# Altium schematic sheet FPGA_IO.SchDoc
size B
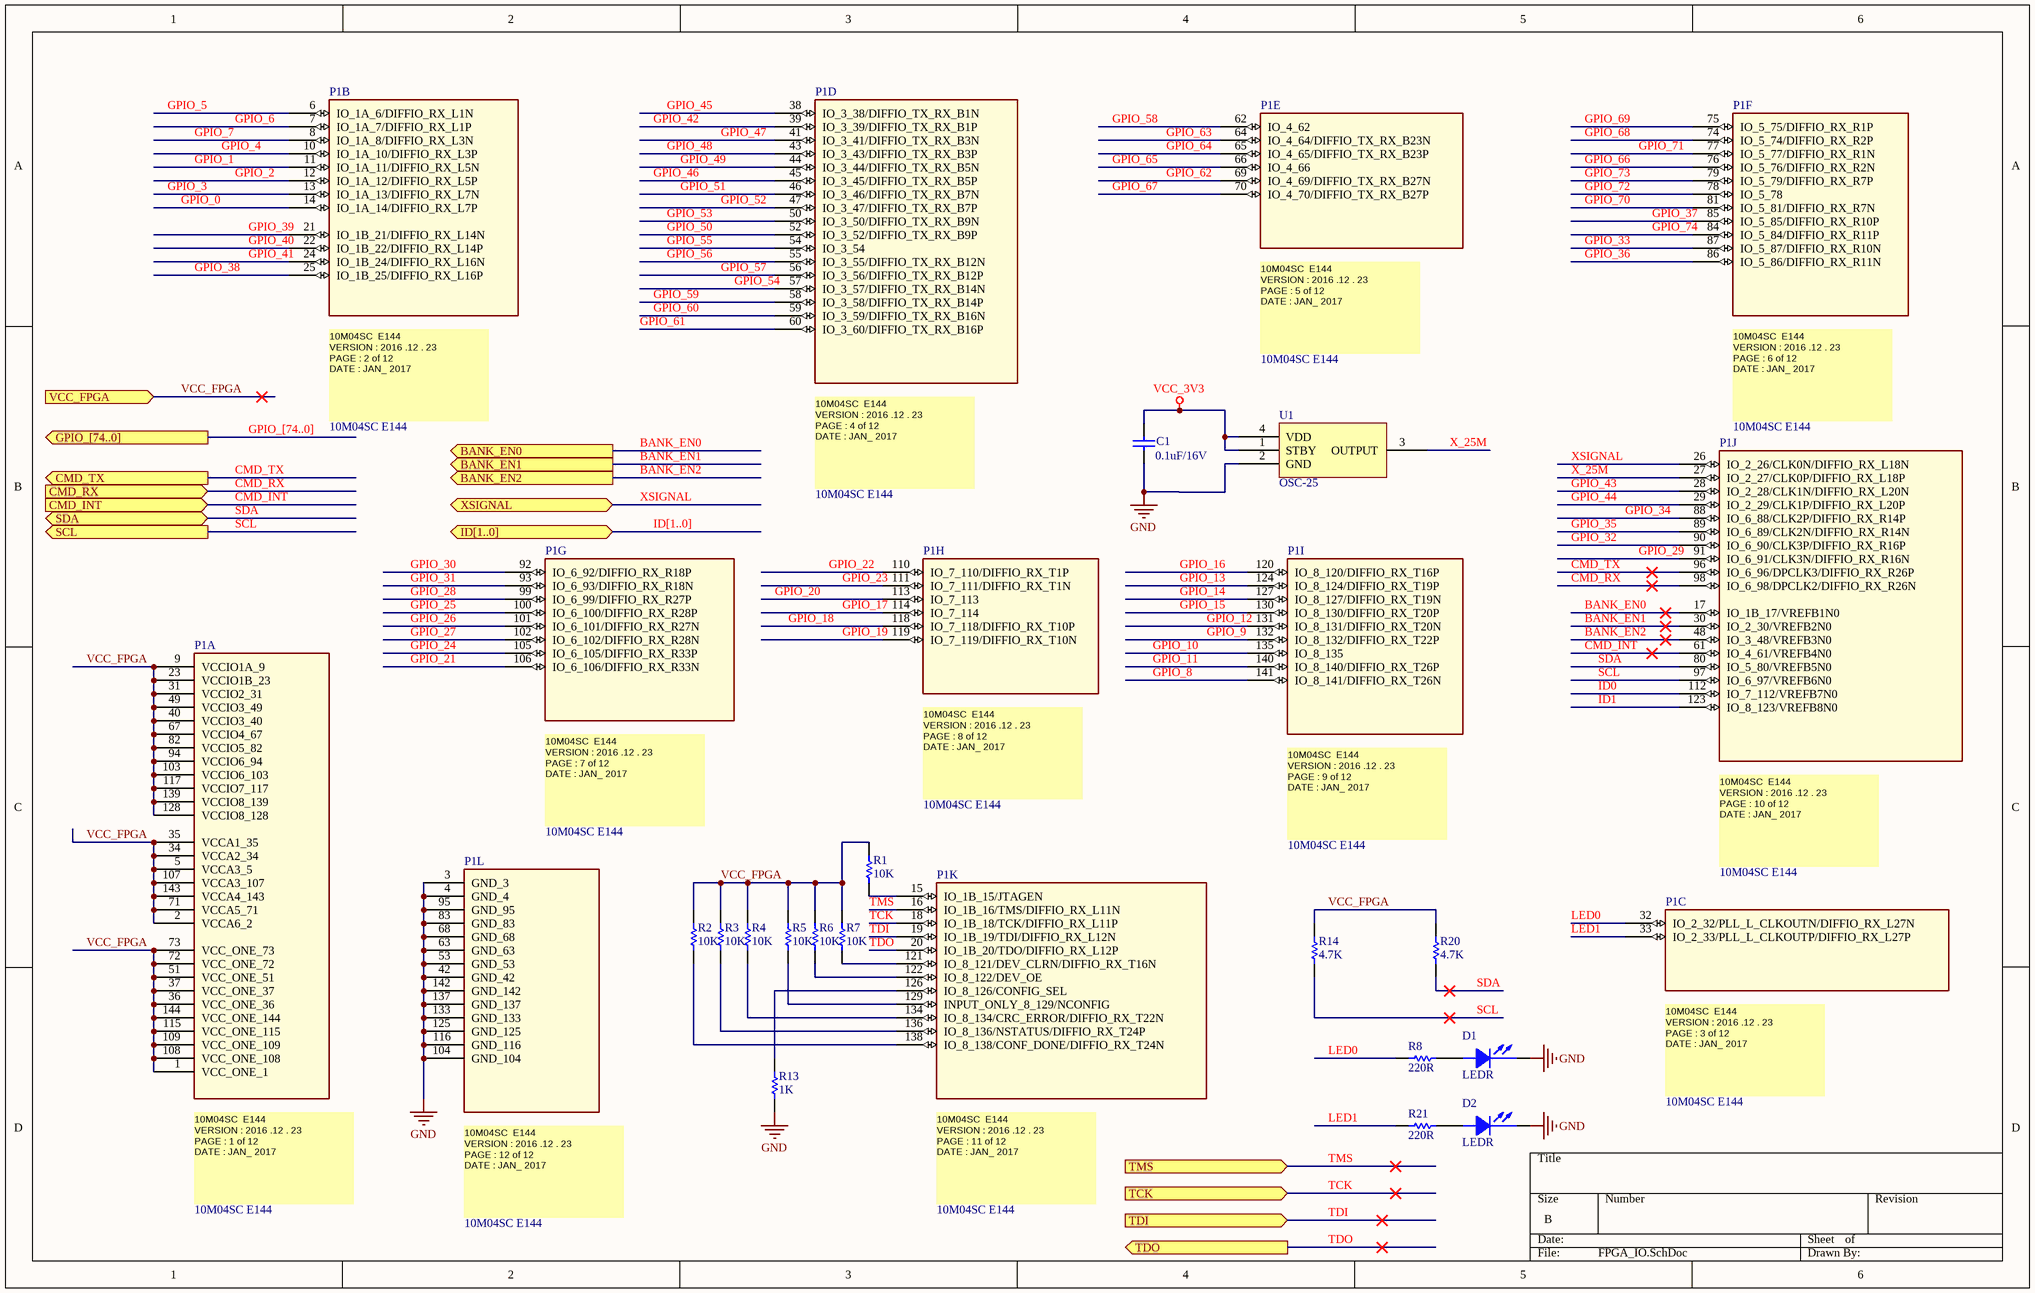
[diagram p0: FPGA_IO.SchDoc]

## Parts
C1  0.1uF/16V  [0603C]
D1  LEDR  [LED_0603]
D2  LEDR  [LED_0603]
P1  10M04SC E144  [10M04SCE144C8G]  (parts A,B,C,D,E,F,G,H,I,J,K,L of 12)
R1  10K  [0603R]
R2  10K  [0603R]
R3  10K  [0603R]
R4  10K  [0603R]
R5  10K  [0603R]
R6  10K  [0603R]
R7  10K  [0603R]
R8  220R  [0603R]
R13  1K  [0603R]
R14  4.7K  [0603R]
R20  4.7K  [0603R]
R21  220R  [0603R]
U1  OSC-25  [ASE-25.000MHZ-LC-T]

## Ports
BANK_EN0 (out), BANK_EN1 (out), BANK_EN2 (out), CMD_INT (in), CMD_RX (in), CMD_TX (out), GPIO_[74..0] (out), ID[1..0] (bidir), SCL (out), SDA (bidir), TCK (in), TDI (in), TDO (out), TMS (in), VCC_FPGA (in), XSIGNAL (bidir)

## Nets
GND: C1.1 D1.2(CATHODE) D2.2(CATHODE) P1.3(GND_3) P1.4(GND_4) P1.42(GND_42) P1.53(GND_53) P1.63(GND_63) P1.68(GND_68) P1.83(GND_83) P1.95(GND_95) P1.104(GND_104) P1.116(GND_116) P1.125(GND_125) P1.133(GND_133) P1.137(GND_137) P1.142(GND_142) R13.1 U1.2(GND)
VCC_3V3: C1.2 U1.1(STBY) U1.4(VDD)
BANK_EN0: P1.17(IO_1B_17/VREFB1N0) ; port BANK_EN0
BANK_EN1: P1.30(IO_2_30/VREFB2N0) ; port BANK_EN1
BANK_EN2: P1.48(IO_3_48/VREFB3N0) ; port BANK_EN2
CMD_INT: P1.61(IO_4_61/VREFB4N0) ; port CMD_INT
CMD_RX: P1.98(IO_6_98/DPCLK2/DIFFIO_RX_R26N) ; port CMD_RX
CMD_TX: P1.96(IO_6_96/DPCLK3/DIFFIO_RX_R26P) ; port CMD_TX
GPIO_0: P1.14(IO_1A_14/DIFFIO_RX_L7P)
GPIO_1: P1.11(IO_1A_11/DIFFIO_RX_L5N)
GPIO_2: P1.12(IO_1A_12/DIFFIO_RX_L5P)
GPIO_3: P1.13(IO_1A_13/DIFFIO_RX_L7N)
GPIO_4: P1.10(IO_1A_10/DIFFIO_RX_L3P)
GPIO_5: P1.6(IO_1A_6/DIFFIO_RX_L1N)
GPIO_6: P1.7(IO_1A_7/DIFFIO_RX_L1P)
GPIO_7: P1.8(IO_1A_8/DIFFIO_RX_L3N)
GPIO_8: P1.141(IO_8_141/DIFFIO_RX_T26N)
GPIO_9: P1.132(IO_8_132/DIFFIO_RX_T22P)
GPIO_10: P1.135(IO_8_135)
GPIO_11: P1.140(IO_8_140/DIFFIO_RX_T26P)
GPIO_12: P1.131(IO_8_131/DIFFIO_RX_T20N)
GPIO_13: P1.124(IO_8_124/DIFFIO_RX_T19P)
GPIO_14: P1.127(IO_8_127/DIFFIO_RX_T19N)
GPIO_15: P1.130(IO_8_130/DIFFIO_RX_T20P)
GPIO_16: P1.120(IO_8_120/DIFFIO_RX_T16P)
GPIO_17: P1.114(IO_7_114)
GPIO_18: P1.118(IO_7_118/DIFFIO_RX_T10P)
GPIO_19: P1.119(IO_7_119/DIFFIO_RX_T10N)
GPIO_20: P1.113(IO_7_113)
GPIO_21: P1.106(IO_6_106/DIFFIO_RX_R33N)
GPIO_22: P1.110(IO_7_110/DIFFIO_RX_T1P)
GPIO_23: P1.111(IO_7_111/DIFFIO_RX_T1N)
GPIO_24: P1.105(IO_6_105/DIFFIO_RX_R33P)
GPIO_25: P1.100(IO_6_100/DIFFIO_RX_R28P)
GPIO_26: P1.101(IO_6_101/DIFFIO_RX_R27N)
GPIO_27: P1.102(IO_6_102/DIFFIO_RX_R28N)
GPIO_28: P1.99(IO_6_99/DIFFIO_RX_R27P)
GPIO_29: P1.91(IO_6_91/CLK3N/DIFFIO_RX_R16N)
GPIO_30: P1.92(IO_6_92/DIFFIO_RX_R18P)
GPIO_31: P1.93(IO_6_93/DIFFIO_RX_R18N)
GPIO_32: P1.90(IO_6_90/CLK3P/DIFFIO_RX_R16P)
GPIO_33: P1.87(IO_5_87/DIFFIO_RX_R10N)
GPIO_34: P1.88(IO_6_88/CLK2P/DIFFIO_RX_R14P)
GPIO_35: P1.89(IO_6_89/CLK2N/DIFFIO_RX_R14N)
GPIO_36: P1.86(IO_5_86/DIFFIO_RX_R11N)
GPIO_37: P1.85(IO_5_85/DIFFIO_RX_R10P)
GPIO_38: P1.25(IO_1B_25/DIFFIO_RX_L16P)
GPIO_39: P1.21(IO_1B_21/DIFFIO_RX_L14N)
GPIO_40: P1.22(IO_1B_22/DIFFIO_RX_L14P)
GPIO_41: P1.24(IO_1B_24/DIFFIO_RX_L16N)
GPIO_42: P1.39(IO_3_39/DIFFIO_TX_RX_B1P)
GPIO_43: P1.28(IO_2_28/CLK1N/DIFFIO_RX_L20N)
GPIO_44: P1.29(IO_2_29/CLK1P/DIFFIO_RX_L20P)
GPIO_45: P1.38(IO_3_38/DIFFIO_TX_RX_B1N)
GPIO_46: P1.45(IO_3_45/DIFFIO_TX_RX_B5P)
GPIO_47: P1.41(IO_3_41/DIFFIO_TX_RX_B3N)
GPIO_48: P1.43(IO_3_43/DIFFIO_TX_RX_B3P)
GPIO_49: P1.44(IO_3_44/DIFFIO_TX_RX_B5N)
GPIO_50: P1.52(IO_3_52/DIFFIO_TX_RX_B9P)
GPIO_51: P1.46(IO_3_46/DIFFIO_TX_RX_B7N)
GPIO_52: P1.47(IO_3_47/DIFFIO_TX_RX_B7P)
GPIO_53: P1.50(IO_3_50/DIFFIO_TX_RX_B9N)
GPIO_54: P1.57(IO_3_57/DIFFIO_TX_RX_B14N)
GPIO_55: P1.54(IO_3_54)
GPIO_56: P1.55(IO_3_55/DIFFIO_TX_RX_B12N)
GPIO_57: P1.56(IO_3_56/DIFFIO_TX_RX_B12P)
GPIO_58: P1.62(IO_4_62)
GPIO_59: P1.58(IO_3_58/DIFFIO_TX_RX_B14P)
GPIO_60: P1.59(IO_3_59/DIFFIO_TX_RX_B16N)
GPIO_61: P1.60(IO_3_60/DIFFIO_TX_RX_B16P)
GPIO_62: P1.69(IO_4_69/DIFFIO_TX_RX_B27N)
GPIO_63: P1.64(IO_4_64/DIFFIO_TX_RX_B23N)
GPIO_64: P1.65(IO_4_65/DIFFIO_TX_RX_B23P)
GPIO_65: P1.66(IO_4_66)
GPIO_66: P1.76(IO_5_76/DIFFIO_RX_R2N)
GPIO_67: P1.70(IO_4_70/DIFFIO_TX_RX_B27P)
GPIO_68: P1.74(IO_5_74/DIFFIO_RX_R2P)
GPIO_69: P1.75(IO_5_75/DIFFIO_RX_R1P)
GPIO_70: P1.81(IO_5_81/DIFFIO_RX_R7N)
GPIO_71: P1.77(IO_5_77/DIFFIO_RX_R1N)
GPIO_72: P1.78(IO_5_78)
GPIO_73: P1.79(IO_5_79/DIFFIO_RX_R7P)
GPIO_74: P1.84(IO_5_84/DIFFIO_RX_R11P)
ID0: P1.112(IO_7_112/VREFB7N0)
ID1: P1.123(IO_8_123/VREFB8N0)
LED0: P1.32(IO_2_32/PLL_L_CLKOUTN/DIFFIO_RX_L27N) R8.2
LED1: P1.33(IO_2_33/PLL_L_CLKOUTP/DIFFIO_RX_L27P) R21.2
SCL: P1.97(IO_6_97/VREFB6N0) R14.1 ; port SCL
SDA: P1.80(IO_5_80/VREFB5N0) R20.1 ; port SDA
TCK: P1.18(IO_1B_18/TCK/DIFFIO_RX_L11P) ; port TCK
TDI: P1.19(IO_1B_19/TDI/DIFFIO_RX_L12N) ; port TDI
TDO: P1.20(IO_1B_20/TDO/DIFFIO_RX_L12P) ; port TDO
TMS: P1.16(IO_1B_16/TMS/DIFFIO_RX_L11N) ; port TMS
VCC_FPGA: P1.1(VCC_ONE_1) P1.2(VCCA6_2) P1.5(VCCA3_5) P1.9(VCCIO1A_9) P1.23(VCCIO1B_23) P1.31(VCCIO2_31) P1.34(VCCA2_34) P1.35(VCCA1_35) P1.36(VCC_ONE_36) P1.37(VCC_ONE_37) P1.40(VCCIO3_40) P1.49(VCCIO3_49) P1.51(VCC_ONE_51) P1.67(VCCIO4_67) P1.71(VCCA5_71) P1.72(VCC_ONE_72) P1.73(VCC_ONE_73) P1.82(VCCIO5_82) P1.94(VCCIO6_94) P1.103(VCCIO6_103) P1.107(VCCA3_107) P1.108(VCC_ONE_108) P1.109(VCC_ONE_109) P1.115(VCC_ONE_115) P1.117(VCCIO7_117) P1.128(VCCIO8_128) P1.139(VCCIO8_139) P1.143(VCCA4_143) P1.144(VCC_ONE_144) R1.1 R2.1 R3.1 R4.1 R5.1 R6.1 R7.1 R14.2 R20.2 ; port VCC_FPGA
X_25M: P1.27(IO_2_27/CLK0P/DIFFIO_RX_L18P) U1.3(OUTPUT)
XSIGNAL: P1.26(IO_2_26/CLK0N/DIFFIO_RX_L18N) ; port XSIGNAL
NetD1_1: D1.1(ANODE) R8.1
NetD2_1: D2.1(ANODE) R21.1
NetP1_15: P1.15(IO_1B_15/JTAGEN) R1.2
NetP1_121: P1.121(IO_8_121/DEV_CLRN/DIFFIO_RX_T16N) R7.2
NetP1_122: P1.122(IO_8_122/DEV_OE) R6.2
NetP1_126: P1.126(IO_8_126/CONFIG_SEL) R13.2
NetP1_129: P1.129(INPUT_ONLY_8_129/NCONFIG) R5.2
NetP1_134: P1.134(IO_8_134/CRC_ERROR/DIFFIO_RX_T22N) R4.2
NetP1_136: P1.136(IO_8_136/NSTATUS/DIFFIO_RX_T24P) R3.2
NetP1_138: P1.138(IO_8_138/CONF_DONE/DIFFIO_RX_T24N) R2.2

## Buses and harness runs
bus GPIO_[74..0] = port GPIO_[74..0]
bus ID[1..0] = port ID[1..0]

## Notes on the sheet
- (in symbol 10M04SC E144, part A) 10M04SC  E144 / VERSION : 2016 .12 . 23 / PAGE : 1 of 12 / DATE : JAN_ 2017 /
- (in symbol 10M04SC E144, part B) 10M04SC  E144 / VERSION : 2016 .12 . 23 / PAGE : 2 of 12 / DATE : JAN_ 2017 /
- (in symbol 10M04SC E144, part C) 10M04SC  E144 / VERSION : 2016 .12 . 23 / PAGE : 3 of 12 / DATE : JAN_ 2017 /
- (in symbol 10M04SC E144, part D) 10M04SC  E144 / VERSION : 2016 .12 . 23 / PAGE : 4 of 12 / DATE : JAN_ 2017 /
- (in symbol 10M04SC E144, part E) 10M04SC  E144 / VERSION : 2016 .12 . 23 / PAGE : 5 of 12 / DATE : JAN_ 2017 /
- (in symbol 10M04SC E144, part F) 10M04SC  E144 / VERSION : 2016 .12 . 23 / PAGE : 6 of 12 / DATE : JAN_ 2017 /
- (in symbol 10M04SC E144, part G) 10M04SC  E144 / VERSION : 2016 .12 . 23 / PAGE : 7 of 12 / DATE : JAN_ 2017 /
- (in symbol 10M04SC E144, part H) 10M04SC  E144 / VERSION : 2016 .12 . 23 / PAGE : 8 of 12 / DATE : JAN_ 2017 /
- (in symbol 10M04SC E144, part I) 10M04SC  E144 / VERSION : 2016 .12 . 23 / PAGE : 9 of 12 / DATE : JAN_ 2017 /
- (in symbol 10M04SC E144, part J) 10M04SC  E144 / VERSION : 2016 .12 . 23 / PAGE : 10 of 12 / DATE : JAN_ 2017 /
- (in symbol 10M04SC E144, part K) 10M04SC  E144 / VERSION : 2016 .12 . 23 / PAGE : 11 of 12 / DATE : JAN_ 2017 /
- (in symbol 10M04SC E144, part L) 10M04SC  E144 / VERSION : 2016 .12 . 23 / PAGE : 12 of 12 / DATE : JAN_ 2017 /

## Library data of the parts
C1 = Cap: Multilayer Ceramic Capacitors MLCC - SMD/SMT 0603 16VDC 0.1uF 10% X7R AEC-Q200; Mfr: Taiyo Yuden; Mfr Part No: EMK107B7104KAHT; Package: 0603; Price: 0.101; Stockiest: MOUSER; Stockiest Part No: 963-EMK107B7104KAHT; Value: 0.1uF/16V
D1 D2 = LED: Standard LEDs - SMD Red 631nm 14mcd 5mA; Mfr: Lite-On; Mfr Part No: LTST-C193KRKT-5A; Package: 0603; Price: 0.393; Stockiest: MOUSER; Stockiest Part No: 859-LTSTC193KRKT5A; Value: RED
P1 = 10M04SC E144: FPGA - Field Programmable Gate Array non-volatile FPGA, 101 I/O, 144EQFP; Mfr: Intel / Altera; Mfr Part No: 10M04SCE144C8G; Package: EQFP144; Price: 11.52; Stockiest: MOUSER; Stockiest Part No: 989-10M04SCE144C8G
R1-R7 = Res1: Thick Film Resistors - SMD 0603 10Kohms 1% Anti-Sulfur AEC-Q200; Mfr: ROHM Semiconductor; Mfr Part No: SFR03EZPF1002; Package: 0603; Price: 0.101; Stockiest: MOUSER; Stockiest Part No: 755-SFR03EZPF1002; Value: 10K
R8 R21 = Res1: Thick Film Resistors - SMD 1/10Watt 220ohms 5% Commercial Use; Mfr: Vishay / Dale; Mfr Part No: CRCW0603220RJNEAC; Package: 0603; Price: 0.101; Stockiest: MOUSER; Stockiest Part No: 71-CRCW0603220RJNEAC; Value: 220R
R13 = Res1: Resistor; Mfr: Vishay / Dale; Mfr Part No: CRCW06031K00FKEAC; Package: 0603; Price: 0.1; Stockiest: MOUSER; Stockiest Part No: 71-CRCW06031K00FKEAC; Value: 1K
R14 R20 = Res1: Thick Film Resistors - SMD 1/10Watt 4.7Kohms 5% Commercial Use; Mfr: Vishay / Dale; Mfr Part No: CRCW06034K70JNEAC; Package: 0603; Price: 0.101; Stockiest: MOUSER; Stockiest Part No: 71-CRCW06034K70JNEAC; Value: 4.7K
U1 = CRYSTAL: Standard Clock Oscillators 25.0 MHZ 3.3V 50PPM SMD 32; Mfr: ABRACON; Value: 25MHZ; Mfr Part No: ASE-25.000MHZ-LC-T; Price: 1.42; Stockiest: MOUSER; Stockiest Part No: 815-ASE25.000MHZLCT